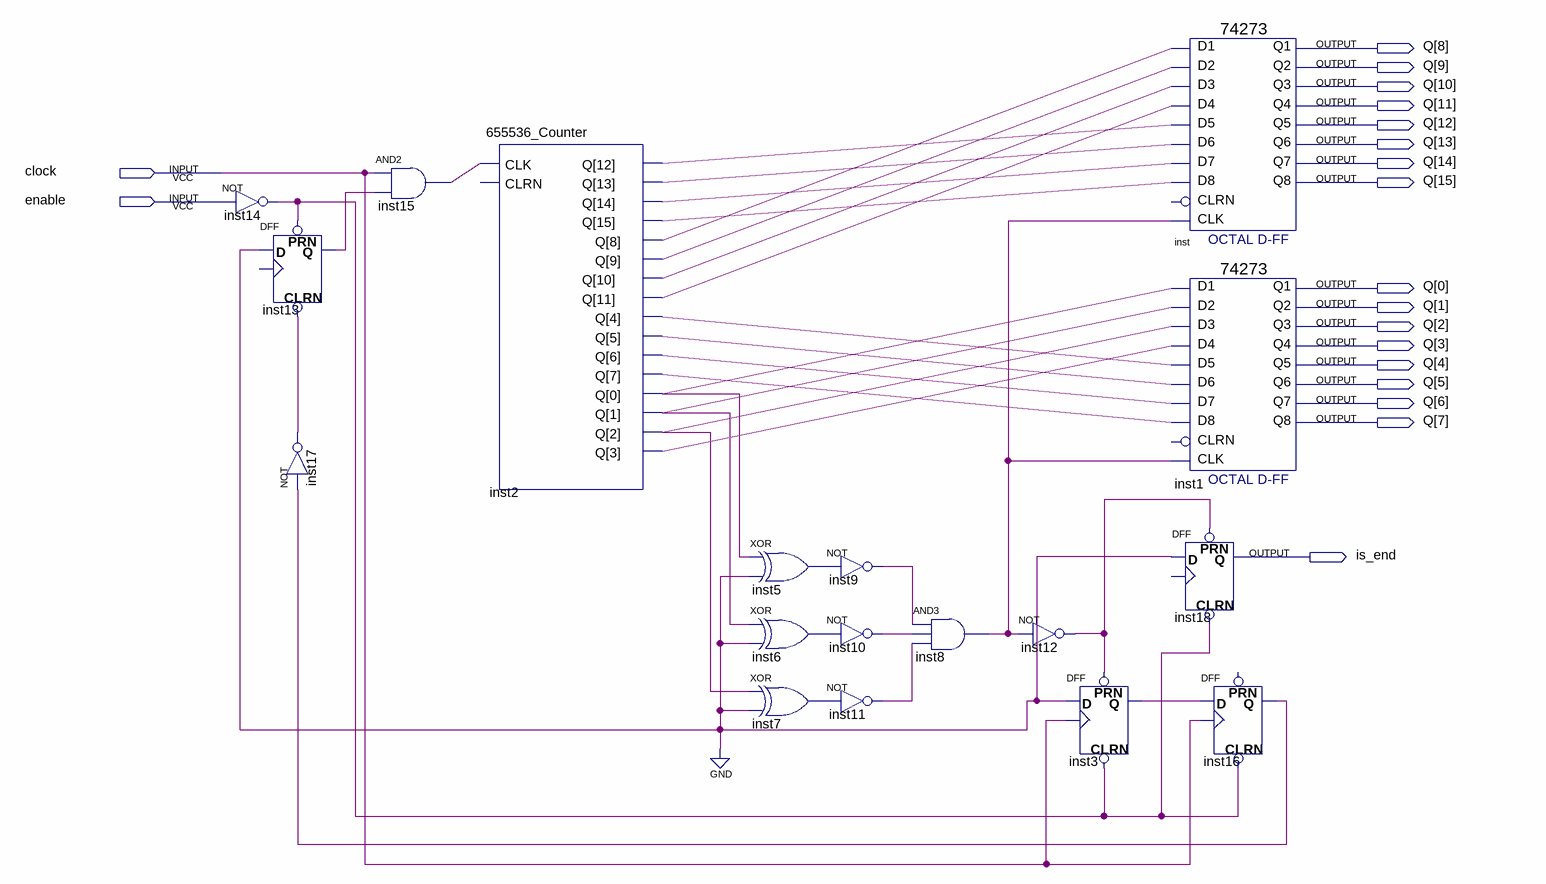
[diagram p0: schematic sheet]
// Quartus schematic peripheral.bdf as structural Verilog: 18 symbols, 19 pins
module peripheral (
  input  clock,
  input  enable,
  output [15:0] Q,
  output is_end
);

  wire inst2_q, inst2_q_2, inst2_q_3, inst2_q_4, inst2_q_5, inst2_q_6, inst2_q_7, inst2_q_8, inst2_q_9,
       inst2_q_10, inst2_q_11, inst2_q_12, inst2_q_13, inst2_q_14, inst2_q_15, inst2_q_16, inst3_q,
       inst5_out, inst6_out, inst7_out, inst8_out, inst9_out, inst10_out, inst11_out, inst12_out, inst13_q,
       inst14_out, inst15_out, inst16_q, inst17_out;

  not inst14 (inst14_out, enable);
  DFF inst13 (.CLRN(inst17_out), .D(1'b0), .PRN(inst14_out), .Q(inst13_q));  // open: CLK
  not inst17 (inst17_out, inst16_q);
  and inst15 (inst15_out, clock, inst13_q);
  \655536_Counter  inst2 (
    .CLK(inst15_out),
    .Q({inst2_q_13, inst2_q_14, inst2_q_15, inst2_q_16, inst2_q_9, inst2_q_10, inst2_q_11, inst2_q_12, inst2_q_5, inst2_q_6, inst2_q_7, inst2_q_8, inst2_q_4, inst2_q_3, inst2_q_2, inst2_q}));  // open: CLRN
  xor inst5 (inst5_out, inst2_q, 1'b0);
  xor inst6 (inst6_out, inst2_q_2, 1'b0);
  xor inst7 (inst7_out, inst2_q_3, 1'b0);
  not inst9 (inst9_out, inst5_out);
  not inst10 (inst10_out, inst6_out);
  not inst11 (inst11_out, inst7_out);
  and inst8 (inst8_out, inst9_out, inst10_out, inst11_out);
  not inst12 (inst12_out, inst8_out);
  DFF inst3 (.CLRN(inst14_out), .CLK(clock), .D(1'b0), .PRN(inst12_out), .Q(inst3_q));
  \74273  inst (
    .D2(inst2_q_11), .D3(inst2_q_10), .D1(inst2_q_12), .D4(inst2_q_9), .D7(inst2_q_14), .D6(inst2_q_15),
    .D5(inst2_q_16), .D8(inst2_q_13), .CLK(inst8_out), .Q4(Q[11]), .Q1(Q[8]), .Q2(Q[9]), .Q3(Q[10]),
    .Q6(Q[13]), .Q5(Q[12]), .Q7(Q[14]), .Q8(Q[15]));  // open: CLRN
  \74273  inst1 (
    .D2(inst2_q_2), .D3(inst2_q_3), .D1(inst2_q), .D4(inst2_q_4), .D7(inst2_q_6), .D6(inst2_q_7),
    .D5(inst2_q_8), .D8(inst2_q_5), .CLK(inst8_out), .Q4(Q[3]), .Q1(Q[0]), .Q2(Q[1]), .Q3(Q[2]), .Q6(Q[5]),
    .Q5(Q[4]), .Q7(Q[6]), .Q8(Q[7]));  // open: CLRN
  DFF inst18 (.CLRN(inst14_out), .D(1'b0), .PRN(inst12_out), .Q(is_end));  // open: CLK
  DFF inst16 (.CLRN(inst14_out), .CLK(clock), .D(inst3_q), .Q(inst16_q));  // open: PRN
endmodule
